# Altium schematic sheet REVISION HISTORY.SchDoc: REVISION HISTORY
size A3; Author: NGUYEN QUANG MINH; SheetNumber: 1; SheetTotal: 5; ProjectTitle: Arduino_DIY_V1.0
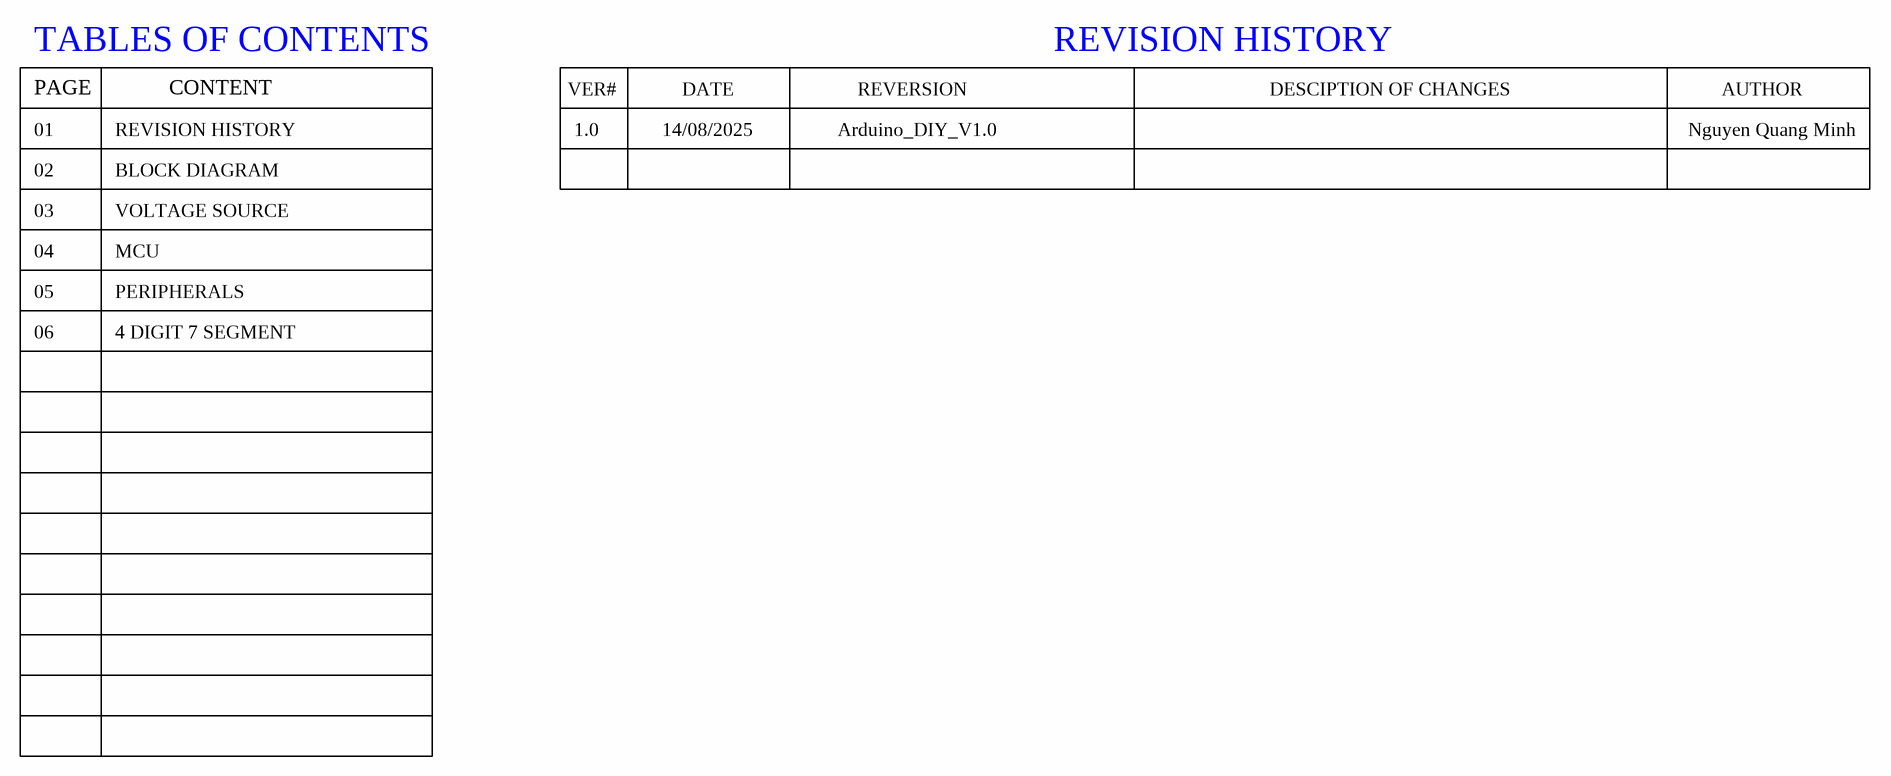
[diagram p0: REVISION HISTORY.SchDoc]

## Notes on the sheet
- TABLES OF CONTENTS
- PAGE
- CONTENT
- VER#
- DATE
- REVERSION
- REVISION HISTORY
- DESCIPTION OF CHANGES
- AUTHOR
- 01
- 1.0
- 14/08/2025
- Arduino_DIY_V1.0
- Nguyen Quang Minh
- 02
- 03
- BLOCK DIAGRAM
- VOLTAGE SOURCE
- 04
- MCU
- 05
- 06
- PERIPHERALS
- 4 DIGIT 7 SEGMENT
- Author:
- Title:
- Size:
- A3
- Project:
- Revision:
- Modified Date:
- CheckedBy:
- Date:
- SW Version: